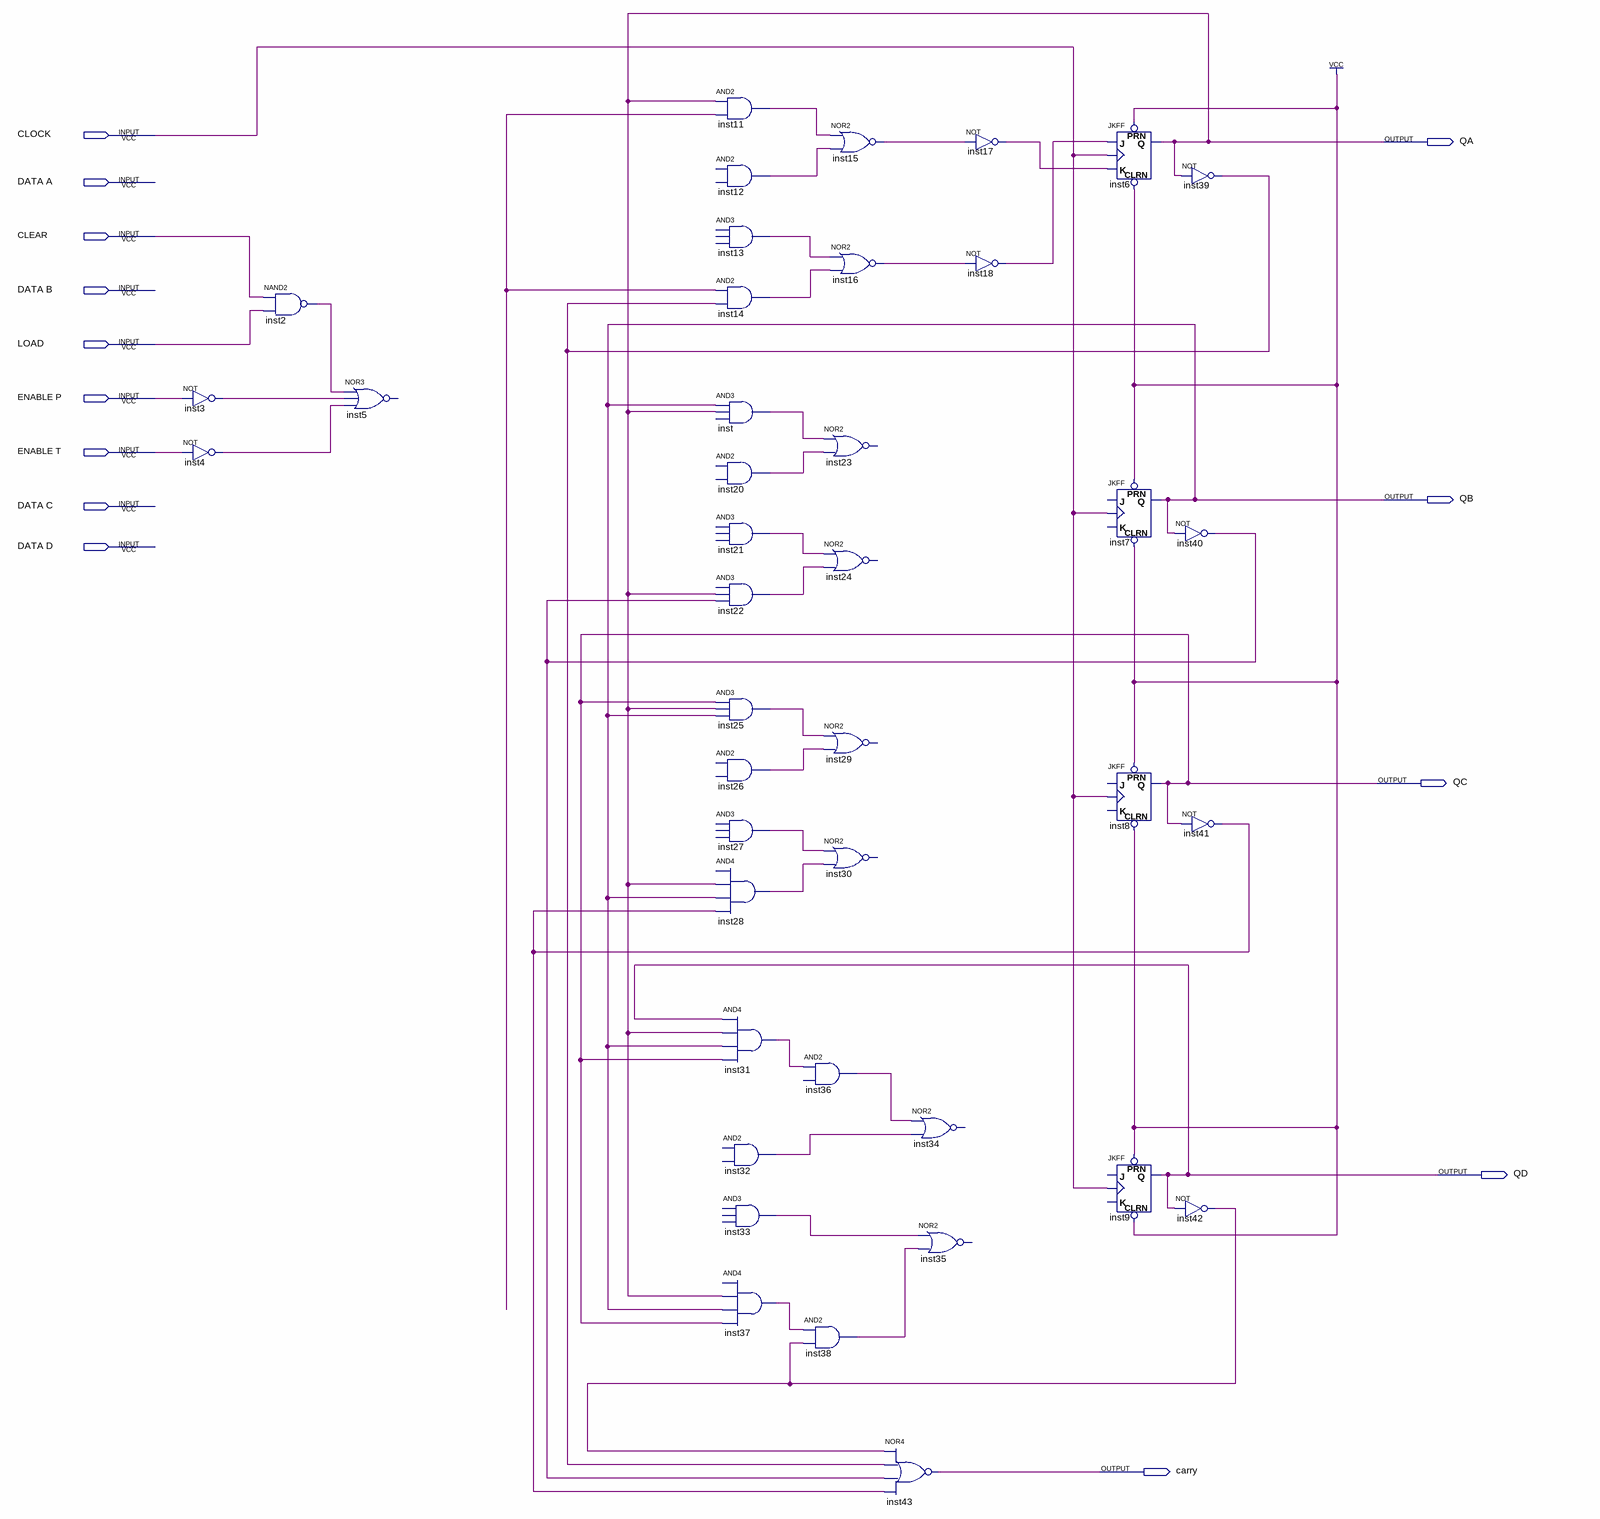
[diagram p0: schematic sheet]
// Quartus schematic ci74161.bdf as structural Verilog: 41 symbols, 14 pins
module ci74161 (
  input  CLOCK,
  input  \DATA_A ,
  input  CLEAR,
  input  \DATA_B ,
  input  LOAD,
  input  \ENABLE_P ,
  input  \ENABLE_T ,
  input  \DATA_C ,
  input  \DATA_D ,
  output QA,
  output QB,
  output QC,
  output QD,
  output carry
);

  wire inst2_out, inst3_out, inst4_out, inst11_out, inst12_out, inst13_out, inst14_out, inst15_out,
       inst16_out, inst17_out, inst18_out, inst20_out, inst21_out, inst22_out, inst25_out, inst26_out,
       inst27_out, inst28_out, inst31_out, inst32_out, inst33_out, inst36_out, inst37_out, inst38_out,
       inst39_out, inst40_out, inst41_out, inst42_out, inst_out, undriven;

  not inst3 (inst3_out, \ENABLE_P );
  not inst4 (inst4_out, \ENABLE_T );
  nand inst2 (inst2_out, CLEAR, LOAD);
  // NOR3 inst5 has open pins: IN1=inst2_out, IN2=inst3_out, IN3=inst4_out, OUT=open
  and inst11 (inst11_out, QA, undriven);
  // AND2 inst12 has open pins: IN1=open, IN2=open, OUT=inst12_out
  // AND3 inst13 has open pins: IN1=open, IN2=open, IN3=open, OUT=inst13_out
  and inst14 (inst14_out, undriven, inst39_out);
  and inst (inst_out, QB, QA);  // open: IN3
  // AND2 inst20 has open pins: IN1=open, IN2=open, OUT=inst20_out
  // AND3 inst21 has open pins: IN1=open, IN2=open, IN3=open, OUT=inst21_out
  and inst22 (inst22_out, QA, inst40_out);  // open: IN1
  and inst25 (inst25_out, QC, QA, QB);
  // AND2 inst26 has open pins: IN1=open, IN2=open, OUT=inst26_out
  // AND3 inst27 has open pins: IN1=open, IN2=open, IN3=open, OUT=inst27_out
  and inst28 (inst28_out, QA, QB, inst41_out);  // open: IN1
  and inst31 (inst31_out, QD, QA, QB, QC);
  // AND2 inst32 has open pins: IN1=open, IN2=open, OUT=inst32_out
  // AND3 inst33 has open pins: IN1=open, IN2=open, IN3=open, OUT=inst33_out
  and inst37 (inst37_out, QA, QB, QC);  // open: IN1
  nor inst15 (inst15_out, inst11_out, inst12_out);
  nor inst16 (inst16_out, inst13_out, inst14_out);
  // NOR2 inst23 has open pins: IN1=inst_out, IN2=inst20_out, OUT=open
  // NOR2 inst24 has open pins: IN1=inst21_out, IN2=inst22_out, OUT=open
  // NOR2 inst29 has open pins: IN1=inst25_out, IN2=inst26_out, OUT=open
  // NOR2 inst30 has open pins: IN1=inst27_out, IN2=inst28_out, OUT=open
  buf inst36 (inst36_out, inst31_out);  // AND2 open: IN2
  and inst38 (inst38_out, inst37_out, inst42_out);
  nor inst43 (carry, inst42_out, inst39_out, inst40_out, inst41_out);
  // NOR2 inst34 has open pins: IN1=inst36_out, IN2=inst32_out, OUT=open
  // NOR2 inst35 has open pins: IN1=inst33_out, IN2=inst38_out, OUT=open
  not inst17 (inst17_out, inst15_out);
  not inst18 (inst18_out, inst16_out);
  JKFF inst6 (.PRN(1'b1), .CLRN(1'b1), .K(inst17_out), .J(inst18_out), .CLK(CLOCK), .Q(QA));
  JKFF inst7 (.PRN(1'b1), .CLRN(1'b1), .CLK(CLOCK), .Q(QB));  // open: K, J
  JKFF inst8 (.PRN(1'b1), .CLRN(1'b1), .CLK(CLOCK), .Q(QC));  // open: K, J
  JKFF inst9 (.PRN(1'b1), .CLRN(1'b1), .CLK(CLOCK), .Q(QD));  // open: K, J
  not inst39 (inst39_out, QA);
  not inst40 (inst40_out, QB);
  not inst41 (inst41_out, QC);
  not inst42 (inst42_out, QD);
endmodule
